# Altium schematic sheet States LED.SchDoc
size 297 x 209 mm; SheetNumber: 3; SheetTotal: 4
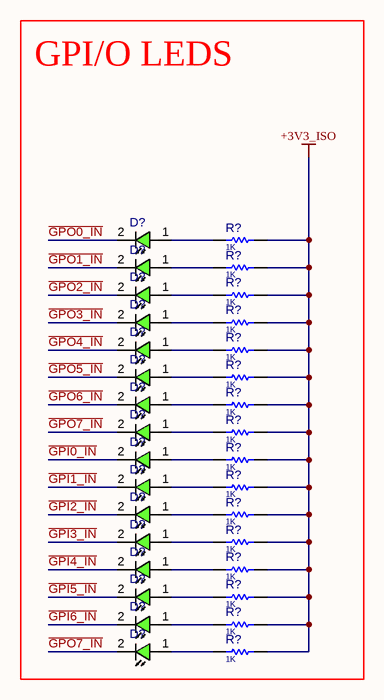
[diagram p0: States LED.SchDoc]

## Parts
(Parts that share a designator on the sheet are numbered #1, #2 ... from top to bottom, then left to right.)
D?#1  (no value)  [LED1206GRN]
D?#2  (no value)  [LED1206GRN]
D?#3  (no value)  [LED1206GRN]
D?#4  (no value)  [LED1206GRN]
D?#5  (no value)  [LED1206GRN]
D?#6  (no value)  [LED1206GRN]
D?#7  (no value)  [LED1206GRN]
D?#8  (no value)  [LED1206GRN]
D?#9  (no value)  [LED1206GRN]
D?#10  (no value)  [LED1206GRN]
D?#11  (no value)  [LED1206GRN]
D?#12  (no value)  [LED1206GRN]
D?#13  (no value)  [LED1206GRN]
D?#14  (no value)  [LED1206GRN]
D?#15  (no value)  [LED1206GRN]
D?#16  (no value)  [LED1206GRN]
R?#1  1K  [R1206]
R?#2  1K  [R1206]
R?#3  1K  [R1206]
R?#4  1K  [R1206]
R?#5  1K  [R1206]
R?#6  1K  [R1206]
R?#7  1K  [R1206]
R?#8  1K  [R1206]
R?#9  1K  [R1206]
R?#10  1K  [R1206]
R?#11  1K  [R1206]
R?#12  1K  [R1206]
R?#13  1K  [R1206]
R?#14  1K  [R1206]
R?#15  1K  [R1206]
R?#16  1K  [R1206]

## Blocks framed on the sheet
GPI/O LEDS: D?#1-D?#16 R?#1-R?#16

## Nets
+3V3_ISO: R?#1.2 R?#2.2 R?#3.2 R?#4.2 R?#5.2 R?#6.2 R?#7.2 R?#8.2 R?#9.2 R?#10.2 R?#11.2 R?#12.2 R?#13.2 R?#14.2 R?#15.2 R?#16.2
~{GPI0_IN}: D?#9.2(CATHODE)
~{GPI1_IN}: D?#10.2(CATHODE)
~{GPI2_IN}: D?#11.2(CATHODE)
~{GPI3_IN}: D?#12.2(CATHODE)
~{GPI4_IN}: D?#13.2(CATHODE)
~{GPI5_IN}: D?#14.2(CATHODE)
~{GPI6_IN}: D?#15.2(CATHODE)
~{GPO0_IN}: D?#1.2(CATHODE)
~{GPO1_IN}: D?#2.2(CATHODE)
~{GPO2_IN}: D?#3.2(CATHODE)
~{GPO3_IN}: D?#4.2(CATHODE)
~{GPO4_IN}: D?#5.2(CATHODE)
~{GPO5_IN}: D?#6.2(CATHODE)
~{GPO6_IN}: D?#7.2(CATHODE)
~{GPO7_IN}: D?#8.2(CATHODE) D?#16.2(CATHODE)
NetD?#1_1: D?#1.1(ANODE) R?#1.1
NetD?#2_1: D?#2.1(ANODE) R?#2.1
NetD?#3_1: D?#3.1(ANODE) R?#3.1
NetD?#4_1: D?#4.1(ANODE) R?#4.1
NetD?#5_1: D?#5.1(ANODE) R?#5.1
NetD?#6_1: D?#6.1(ANODE) R?#6.1
NetD?#7_1: D?#7.1(ANODE) R?#7.1
NetD?#8_1: D?#8.1(ANODE) R?#8.1
NetD?#9_1: D?#9.1(ANODE) R?#9.1
NetD?#10_1: D?#10.1(ANODE) R?#10.1
NetD?#11_1: D?#11.1(ANODE) R?#11.1
NetD?#12_1: D?#12.1(ANODE) R?#12.1
NetD?#13_1: D?#13.1(ANODE) R?#13.1
NetD?#14_1: D?#14.1(ANODE) R?#14.1
NetD?#15_1: D?#15.1(ANODE) R?#15.1
NetD?#16_1: D?#16.1(ANODE) R?#16.1

## Notes on the sheet
- Drawn
- Name
- Date
- Drawing Title
- Checked
- Drawing No.
- Approved
- Size
- A4
- Ver.
- Rev.
- Sheet
- Of

## Library data of the parts
D?#1-D?#16 = LED_SMD_1206_GRN: LED, SMD, 1206, GREEN; PARAM: 20mA; DESC: DESCRIPTION; PARAM2: 2.2V; MANF: -; ASSEMBLY: ASSEMBLY; PRICE: 36t@Javan; MANF_P#: -
R?#1-R?#16 = RES_SMD_1206: RESISTOR, SMD; PARAM: -W; DESC: DESCRIPTION; DIST#: MOUSER; PARAM2: 1%; MANF_P#: -; MANF: -; ASSEMBLY: ASSEMBLY; PRICE: 100= 0.5$; VALUE: 1K